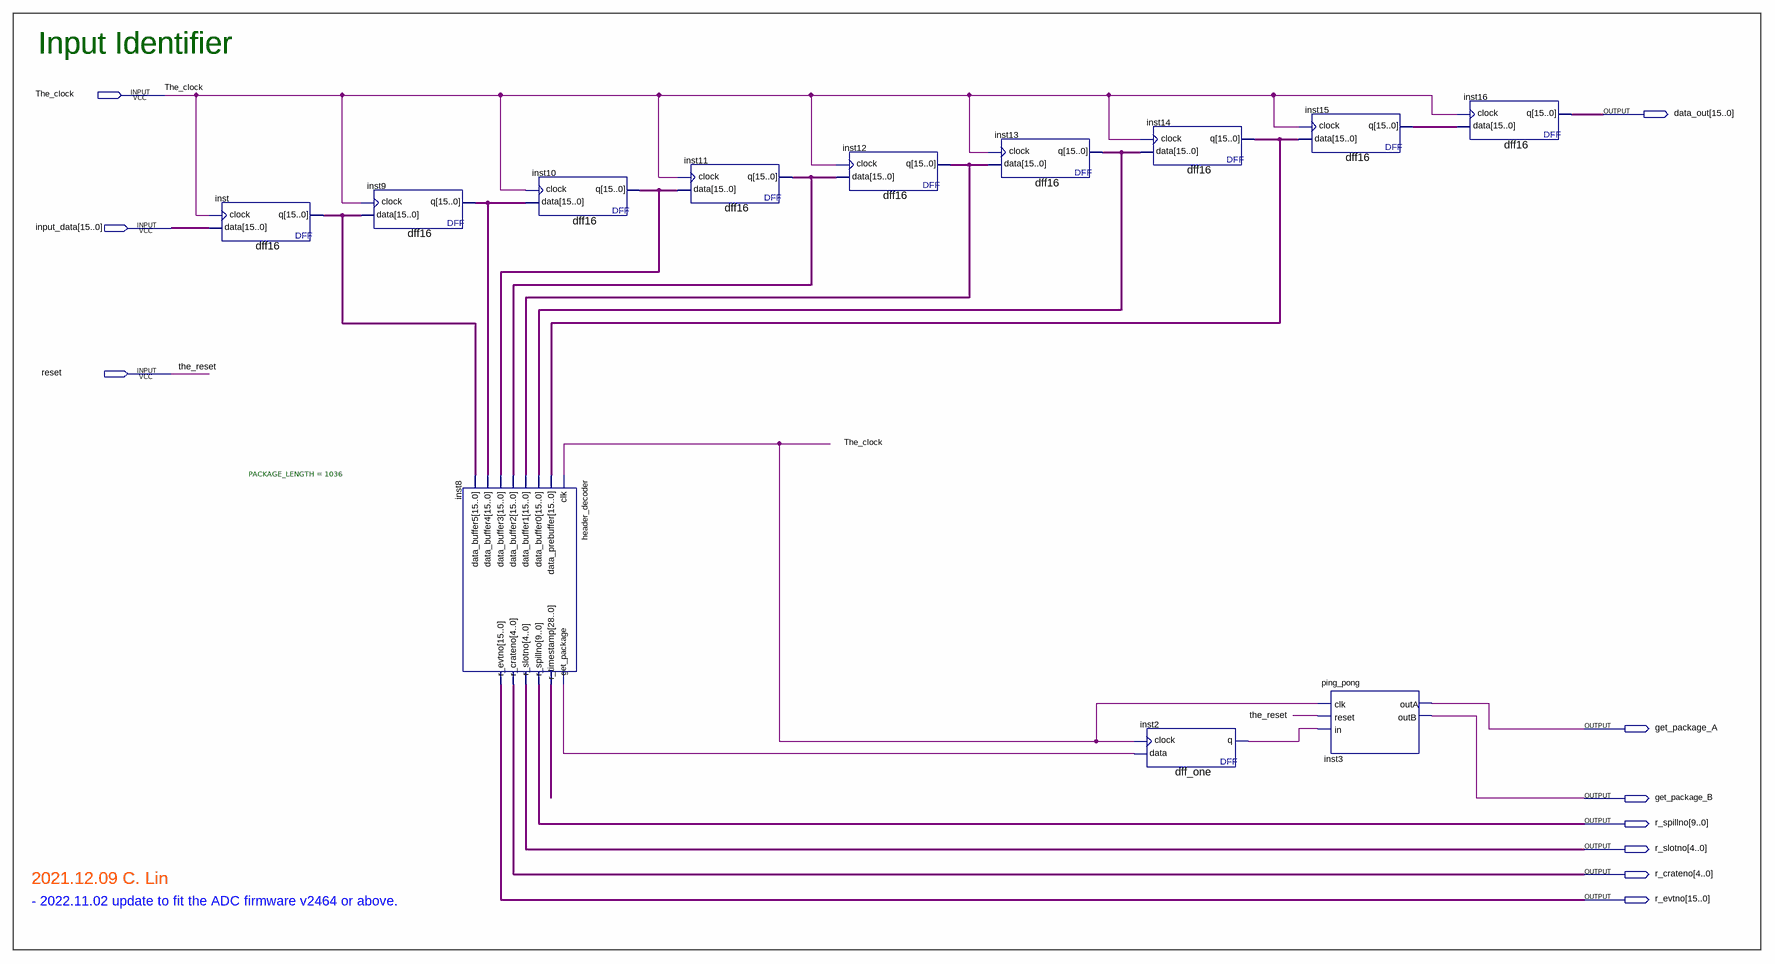
[diagram p0: schematic sheet]
// Quartus schematic input_identifier.bdf as structural Verilog: 12 symbols, 10 pins
module input_identifier (
  input  The_clock,
  input  [15:0] input_data,
  input  reset,
  output [15:0] data_out,
  output get_package_A,
  output get_package_B,
  output [9:0] r_spillno,
  output [4:0] r_slotno,
  output [4:0] r_crateno,
  output [15:0] r_evtno
);

  wire inst2_q, inst8_get_package;
  wire [15:0] inst9_q, inst10_q, inst11_q, inst12_q, inst13_q, inst14_q, inst15_q, inst_q;
  wire [28:0] inst8_r_timestamp;

  dff16 inst (.data(input_data), .clock(The_clock), .q(inst_q));
  dff16 inst9 (.data(inst_q), .clock(The_clock), .q(inst9_q));
  header_decoder #(.PACKAGE_LENGTH(1036)) inst8 (
    .clk(The_clock), .data_prebuffer(inst14_q), .data_buffer0(inst13_q), .data_buffer1(inst12_q),
    .data_buffer2(inst11_q), .data_buffer3(inst10_q), .data_buffer4(inst9_q), .data_buffer5(inst_q),
    .get_package(inst8_get_package), .r_timestamp(inst8_r_timestamp), .r_spillno(r_spillno),
    .r_slotno(r_slotno), .r_crateno(r_crateno), .r_evtno(r_evtno));
  dff16 inst10 (.data(inst9_q), .clock(The_clock), .q(inst10_q));
  dff16 inst11 (.data(inst10_q), .clock(The_clock), .q(inst11_q));
  dff16 inst12 (.data(inst11_q), .clock(The_clock), .q(inst12_q));
  dff16 inst13 (.data(inst12_q), .clock(The_clock), .q(inst13_q));
  dff16 inst14 (.data(inst13_q), .clock(The_clock), .q(inst14_q));
  dff_one inst2 (.data(inst8_get_package), .clock(The_clock), .q(inst2_q));
  dff16 inst15 (.data(inst14_q), .clock(The_clock), .q(inst15_q));
  ping_pong inst3 (.clk(The_clock), .reset(reset), .in(inst2_q), .outA(get_package_A), .outB(get_package_B));
  dff16 inst16 (.data(inst15_q), .clock(The_clock), .q(data_out));

  // Other names for the same wires on the sheet: the_reset = reset

  // Notes on the sheet:
  //   Input Identifier
  //   Input Identifier
  //   2021.12.09 C. Lin
  //   - 2022.11.02 update to fit the ADC firmware v2464 or above.
endmodule
